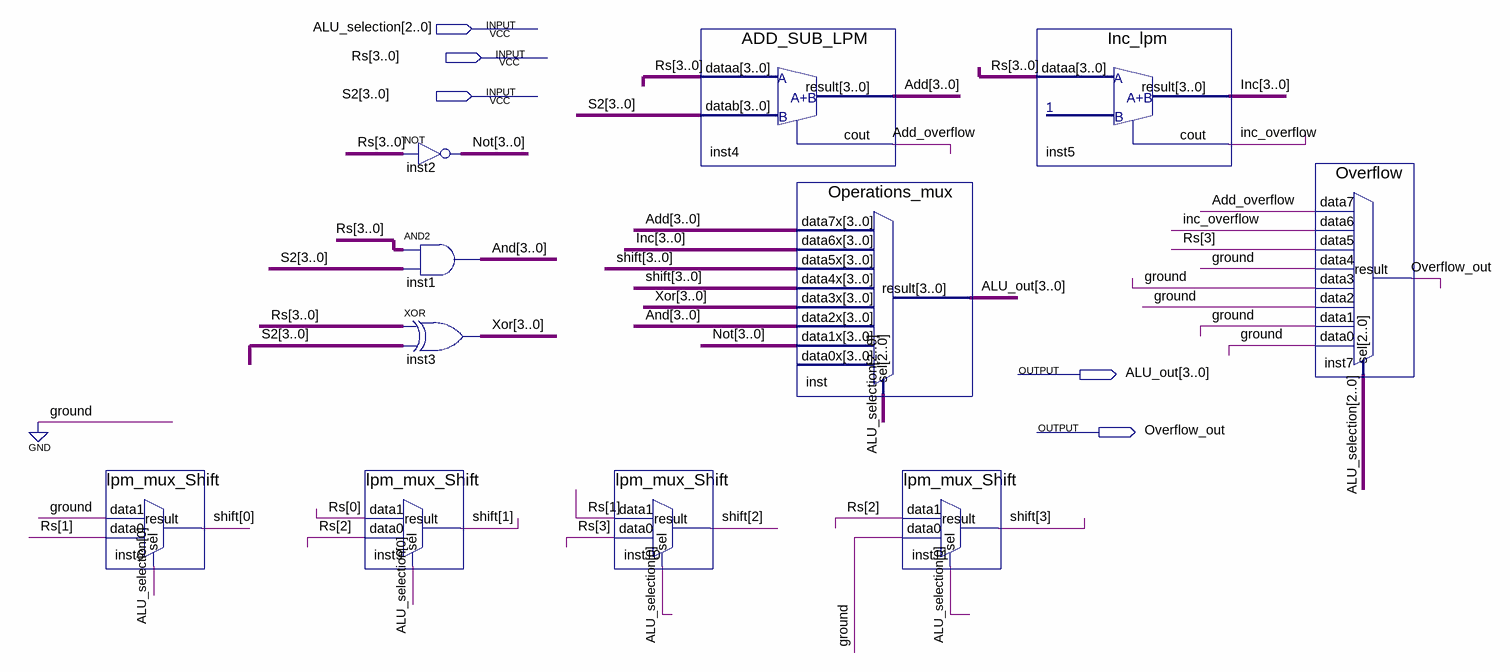
[diagram p0: schematic sheet]
// Quartus schematic YASSER_ELHASAN_2019510006_ALU.bdf as structural Verilog: 11 symbols, 5 pins
module YASSER_ELHASAN_2019510006_ALU (
  input  [2:0] ALU_selection,
  input  [3:0] Rs,
  input  [3:0] S2,
  output [3:0] ALU_out,
  output Overflow_out
);

  wire Add_overflow, inc_overflow;
  wire [3:0] Add, And, Inc, Not, shift, Xor;

  lpm_mux_Shift inst6 (.data1(1'b0), .data0(Rs[1]), .sel(ALU_selection[0]), .result(shift[0]));
  assign Not = ~Rs;  // NOT inst2, 4 bits wide
  assign And = Rs & S2;  // AND2 inst1, 4 bits wide
  assign Xor = Rs ^ S2;  // XOR inst3, 4 bits wide
  lpm_mux_Shift inst9 (.data1(Rs[0]), .data0(Rs[2]), .sel(ALU_selection[0]), .result(shift[1]));
  lpm_mux_Shift inst10 (.data1(Rs[1]), .data0(Rs[3]), .sel(ALU_selection[0]), .result(shift[2]));
  ADD_SUB_LPM inst4 (.dataa(Rs), .datab(S2), .result(Add), .cout(Add_overflow));
  Operations_mux inst (
    .data7x(Add), .data6x(Inc), .data5x(shift), .data4x(shift), .data3x(Xor), .data2x(And), .data1x(Not),
    .sel(ALU_selection), .result(ALU_out));  // open: data0x
  lpm_mux_Shift inst11 (.data1(Rs[2]), .data0(1'b0), .sel(ALU_selection[0]), .result(shift[3]));
  Inc_lpm inst5 (.dataa(Rs), .result(Inc), .cout(inc_overflow));
  Overflow inst7 (
    .data7(Add_overflow), .data6(inc_overflow), .data5(Rs[3]), .data4(1'b0), .data3(1'b0), .data2(1'b0),
    .data1(1'b0), .data0(1'b0), .sel(ALU_selection), .result(Overflow_out));
endmodule
